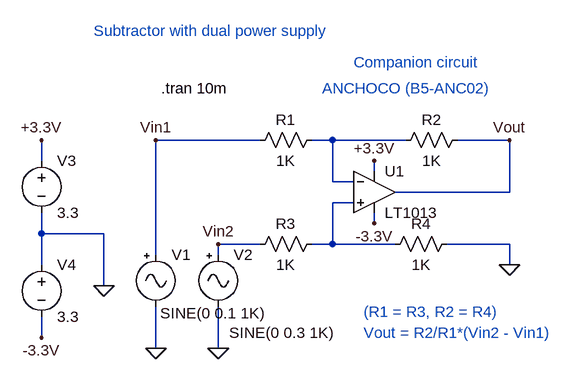
[diagram p0: schematic subtractorr_with_dual_pow.asc]
subtractorr_with_dual_pow.asc, the LTspice schematic file:
Version 4
SHEET 1 948 680
WIRE -208 0 -368 0
WIRE -96 0 -128 0
WIRE 16 0 -96 0
WIRE 176 0 96 0
WIRE -544 32 -544 0
WIRE -32 48 -32 32
WIRE -96 64 -96 0
WIRE -64 64 -96 64
WIRE 176 80 176 0
WIRE 176 80 0 80
WIRE -64 96 -96 96
WIRE -32 128 -32 112
WIRE -544 144 -544 112
WIRE -448 144 -544 144
WIRE -208 160 -272 160
WIRE -96 160 -96 96
WIRE -96 160 -128 160
WIRE 0 160 -96 160
WIRE 176 160 80 160
WIRE -368 176 -368 0
WIRE -272 176 -272 160
WIRE -544 192 -544 144
WIRE 176 192 176 160
WIRE -448 224 -448 144
WIRE -544 304 -544 272
WIRE -368 320 -368 256
WIRE -272 320 -272 256
FLAG -448 224 0
FLAG -544 0 +3.3V
FLAG -544 304 -3.3V
FLAG -32 32 +3.3V
FLAG -32 128 -3.3V
FLAG -272 320 0
FLAG 176 0 Vout
FLAG -368 320 0
FLAG -272 160 Vin2
FLAG -368 0 Vin1
FLAG 176 192 0
SYMBOL voltage -544 16 R0
WINDOW 123 0 0 Left 0
WINDOW 39 0 0 Left 0
SYMATTR InstName V3
SYMATTR Value 3.3
SYMBOL voltage -544 176 R0
WINDOW 123 0 0 Left 0
WINDOW 39 0 0 Left 0
SYMATTR InstName V4
SYMATTR Value 3.3
SYMBOL res 0 16 R270
WINDOW 0 32 56 VTop 2
WINDOW 3 0 56 VBottom 2
SYMATTR InstName R2
SYMATTR Value 1K
SYMBOL Misc\\signal -272 160 R0
WINDOW 123 0 0 Left 0
WINDOW 39 0 0 Left 0
WINDOW 3 17 136 Left 2
SYMATTR InstName V2
SYMATTR Value SINE(0 0.3 1K)
SYMBOL Opamps\\LT1013 -32 16 R0
SYMATTR InstName U1
SYMBOL Misc\\signal -368 160 R0
WINDOW 123 0 0 Left 0
WINDOW 39 0 0 Left 0
WINDOW 3 7 106 Left 2
SYMATTR InstName V1
SYMATTR Value SINE(0 0.1 1K)
SYMBOL res -112 144 R90
WINDOW 0 0 56 VBottom 2
WINDOW 3 32 56 VTop 2
SYMATTR InstName R3
SYMATTR Value 1K
SYMBOL res -112 -16 R90
WINDOW 0 0 56 VBottom 2
WINDOW 3 32 56 VTop 2
SYMATTR InstName R1
SYMATTR Value 1K
SYMBOL res 96 144 R90
WINDOW 0 0 56 VBottom 2
WINDOW 3 32 56 VTop 2
SYMATTR InstName R4
SYMATTR Value 1K
TEXT -360 -80 Left 2 !.tran 10m
TEXT -464 -168 Left 2 ;Subtractor with dual power supply
TEXT -112 -80 Left 2 ;ANCHOCO (B5-ANC02)
TEXT -64 -120 Left 2 ;Companion circuit
TEXT -48 264 Left 2 ;(R1 = R3, R2 = R4)
TEXT -48 296 Left 2 ;Vout = R2/R1*(Vin2 - Vin1)

The netlist it stands for:
* subtractorr_with_dual_pow.asc
V3 +3.3V 0 3.3
V4 0 -3.3V 3.3
R2 N001 Vout 1K
V2 Vin2 0 SINE(0 0.3 1K)
XU1 N002 N001 +3.3V -3.3V Vout LT1013  ; pins In+ In- V+ V- OUT
V1 Vin1 0 SINE(0 0.1 1K)
R3 N002 Vin2 1K
R1 N001 Vin1 1K
R4 0 N002 1K
.tran 10m
* Subtractor with dual power supply
* ANCHOCO (B5-ANC02)
* Companion circuit
* (R1 = R3, R2 = R4)
* Vout = R2/R1*(Vin2 - Vin1)
.lib LTC.lib
.backanno
.end